# Altium schematic sheet ZHSD-MIPI-CSI2.SchDoc
size A4; DocumentNumber: 16; SheetNumber: 16; SheetTotal: 17; Size: A4
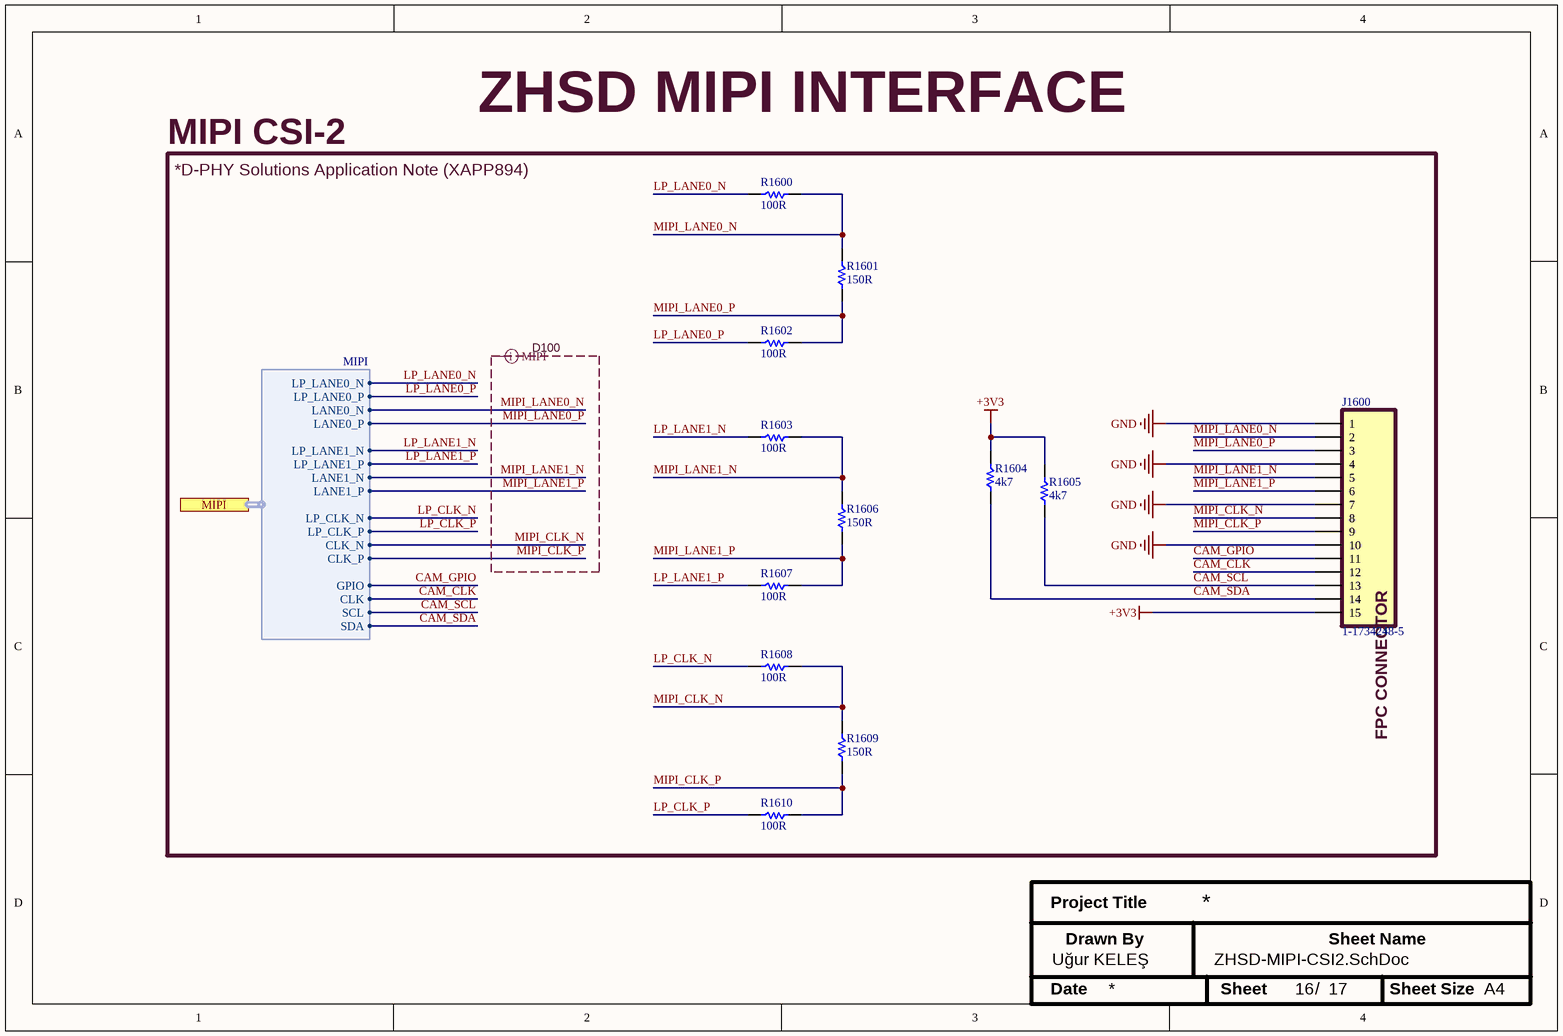
[diagram p0: ZHSD-MIPI-CSI2.SchDoc]

## Parts
J1600  1-1734248-5  [TE_1-1734248-5]
R1600  100R  [0402RESC1005X04N]
R1601  150R  [0402RESC1005X04N]
R1602  100R  [0402RESC1005X04N]
R1603  100R  [0402RESC1005X04N]
R1604  4k7  [0402RESC1005X04N]
R1605  4k7  [0402RESC1005X04N]
R1606  150R  [0402RESC1005X04N]
R1607  100R  [0402RESC1005X04N]
R1608  100R  [0402RESC1005X04N]
R1609  150R  [0402RESC1005X04N]
R1610  100R  [0402RESC1005X04N]

## Ports
MIPI (harness MIPI, see ZHSD-Block[3600,1100], ZHSD-ZYNQ-PL[600,2200])

## Harnesses
MIPI: LANE0_N, LANE0_P, LANE1_N, LANE1_P, CLK_N, CLK_P, GPIO, CLK, SCL, SDA, LP_LANE0_N, LP_LANE0_P, LP_LANE1_N, LP_LANE1_P, LP_CLK_N, LP_CLK_P

## Nets
+3V3: J1600.15 R1604.2 R1605.2
GND: J1600.1 J1600.4 J1600.7 J1600.10
CAM_CLK: J1600.12 ; port MIPI.CLK
CAM_GPIO: J1600.11 ; port MIPI.GPIO
CAM_SCL: J1600.13 R1605.1 ; port MIPI.SCL
CAM_SDA: J1600.14 R1604.1 ; port MIPI.SDA
LP_CLK_N: R1608.2 ; port MIPI.LP_CLK_N
LP_CLK_P: R1610.2 ; port MIPI.LP_CLK_P
LP_LANE0_N: R1600.2 ; port MIPI.LP_LANE0_N
LP_LANE0_P: R1602.2 ; port MIPI.LP_LANE0_P
LP_LANE1_N: R1603.2 ; port MIPI.LP_LANE1_N
LP_LANE1_P: R1607.2 ; port MIPI.LP_LANE1_P
MIPI_CLK_N: J1600.8 R1608.1 R1609.2 ; port MIPI.CLK_N
MIPI_CLK_P: J1600.9 R1609.1 R1610.1 ; port MIPI.CLK_P
MIPI_LANE0_N: J1600.2 R1600.1 R1601.2 ; port MIPI.LANE0_N
MIPI_LANE0_P: J1600.3 R1601.1 R1602.1 ; port MIPI.LANE0_P
MIPI_LANE1_N: J1600.5 R1603.1 R1606.2 ; port MIPI.LANE1_N
MIPI_LANE1_P: J1600.6 R1606.1 R1607.1 ; port MIPI.LANE1_P

## Layout directives
differential pair; differential pair class MIPI; rule Differential Pairs Routing [Pref Gap = 10mil    Min Gap  = 5mil    Max Gap  = 10milPref Width = 3.937mil    Min Width  = 3.543mil    Max Width  = 3.937mil]; Impedance: D100: MIPI_CLK_N, MIPI_CLK_P, MIPI_LANE0_N, MIPI_LANE0_P, MIPI_LANE1_N, MIPI_LANE1_P

## Notes on the sheet
- MIPI CSI-2
- *D-PHY Solutions Application Note (XAPP894)
- ZHSD MIPI INTERFACE
- Project Title
- Uğur KELEŞ
- Drawn By
- Sheet Name
- Date
- Sheet
- /
- Sheet Size
- A4
- (in symbol 1-1734248-5) FPC CONNECTOR

## Library data of the parts
J1600 = 1-1734248-5: CONN FPC VERT 15POS 1MM SMD; pin to pad: 1>1+1_1 2>2+2_1 3>3+3_1 4>4+4_1 5>5+5_1 6>6+6_1 7>7+7_1 8>8+8_1 9>9+9_1 10>10+10_1 11>11+11_1 12>12+12_1 13>13+13_1 14>14+14_1 15>15+15_1; Manufacturer: TE Connectivity AMP Connectors; ComponentLink2Description: Drawing; ComponentLink2URL: https://www.te.com/commerce/DocumentDelivery/DDEController?Action=srchrtrv&DocNm=1734248&DocType=Customer%20Drawing&DocLang=English&DocFormat=pdf&PartCntxt=1-1734248-5; ComponentLink3Description: Product Specification; ComponentLink3URL: https://www.te.com/commerce/DocumentDelivery/DDEController?Action=srchrtrv&DocNm=108-57080&DocType=Specification%20Or%20Standard&DocLang=English&DocFormat=pdf&PartCntxt=1-1734248-5; MPN: 1-1734248-5
R1600 R1602 R1603 R1607 R1608 R1610 = RC0402FR-07100RL: RES 100 OHM 1% 1/16W 0402 (1005); Manufacturer: YAGEO; Value: 100 Ohms; Voltage: 50V; ComponentLink1Description: Datasheet; ComponentLink1URL: https://yageogroup.com/content/datasheet/asset/file/PYU-RC_GROUP_51_ROHS_L; MPN: RC0402FR-07100RL; Tolerance: ±1%; Package: 0402
R1601 R1606 R1609 = RC0402FR-07150RL: RES 150 OHM 1% 1/16W 0402 (1005); Manufacturer: YAGEO; Value: 150 Ohms; Voltage: 50V; ComponentLink1Description: Datasheet; ComponentLink1URL: https://yageogroup.com/content/datasheet/asset/file/PYU-RC_GROUP_51_ROHS_L; MPN: RC0402FR-07150RL; Tolerance: ±1%; Package: 0402
R1604 R1605 = RC0402JR-074K7L: RES 4.7K OHM 5% 1/16W 0402 (1005); Manufacturer: YAGEO; MPN: RT0402FRE0780RL; Value: 4.7 kOhms; Voltage: 50V; ComponentLink1Description: Datasheet; ComponentLink1URL: https://yageogroup.com/content/datasheet/asset/file/PYU-RC_GROUP_51_ROHS_L; Tolerance: ±5%; Package: 0402